# Altium schematic sheet Sheet1.SchDoc
size A3
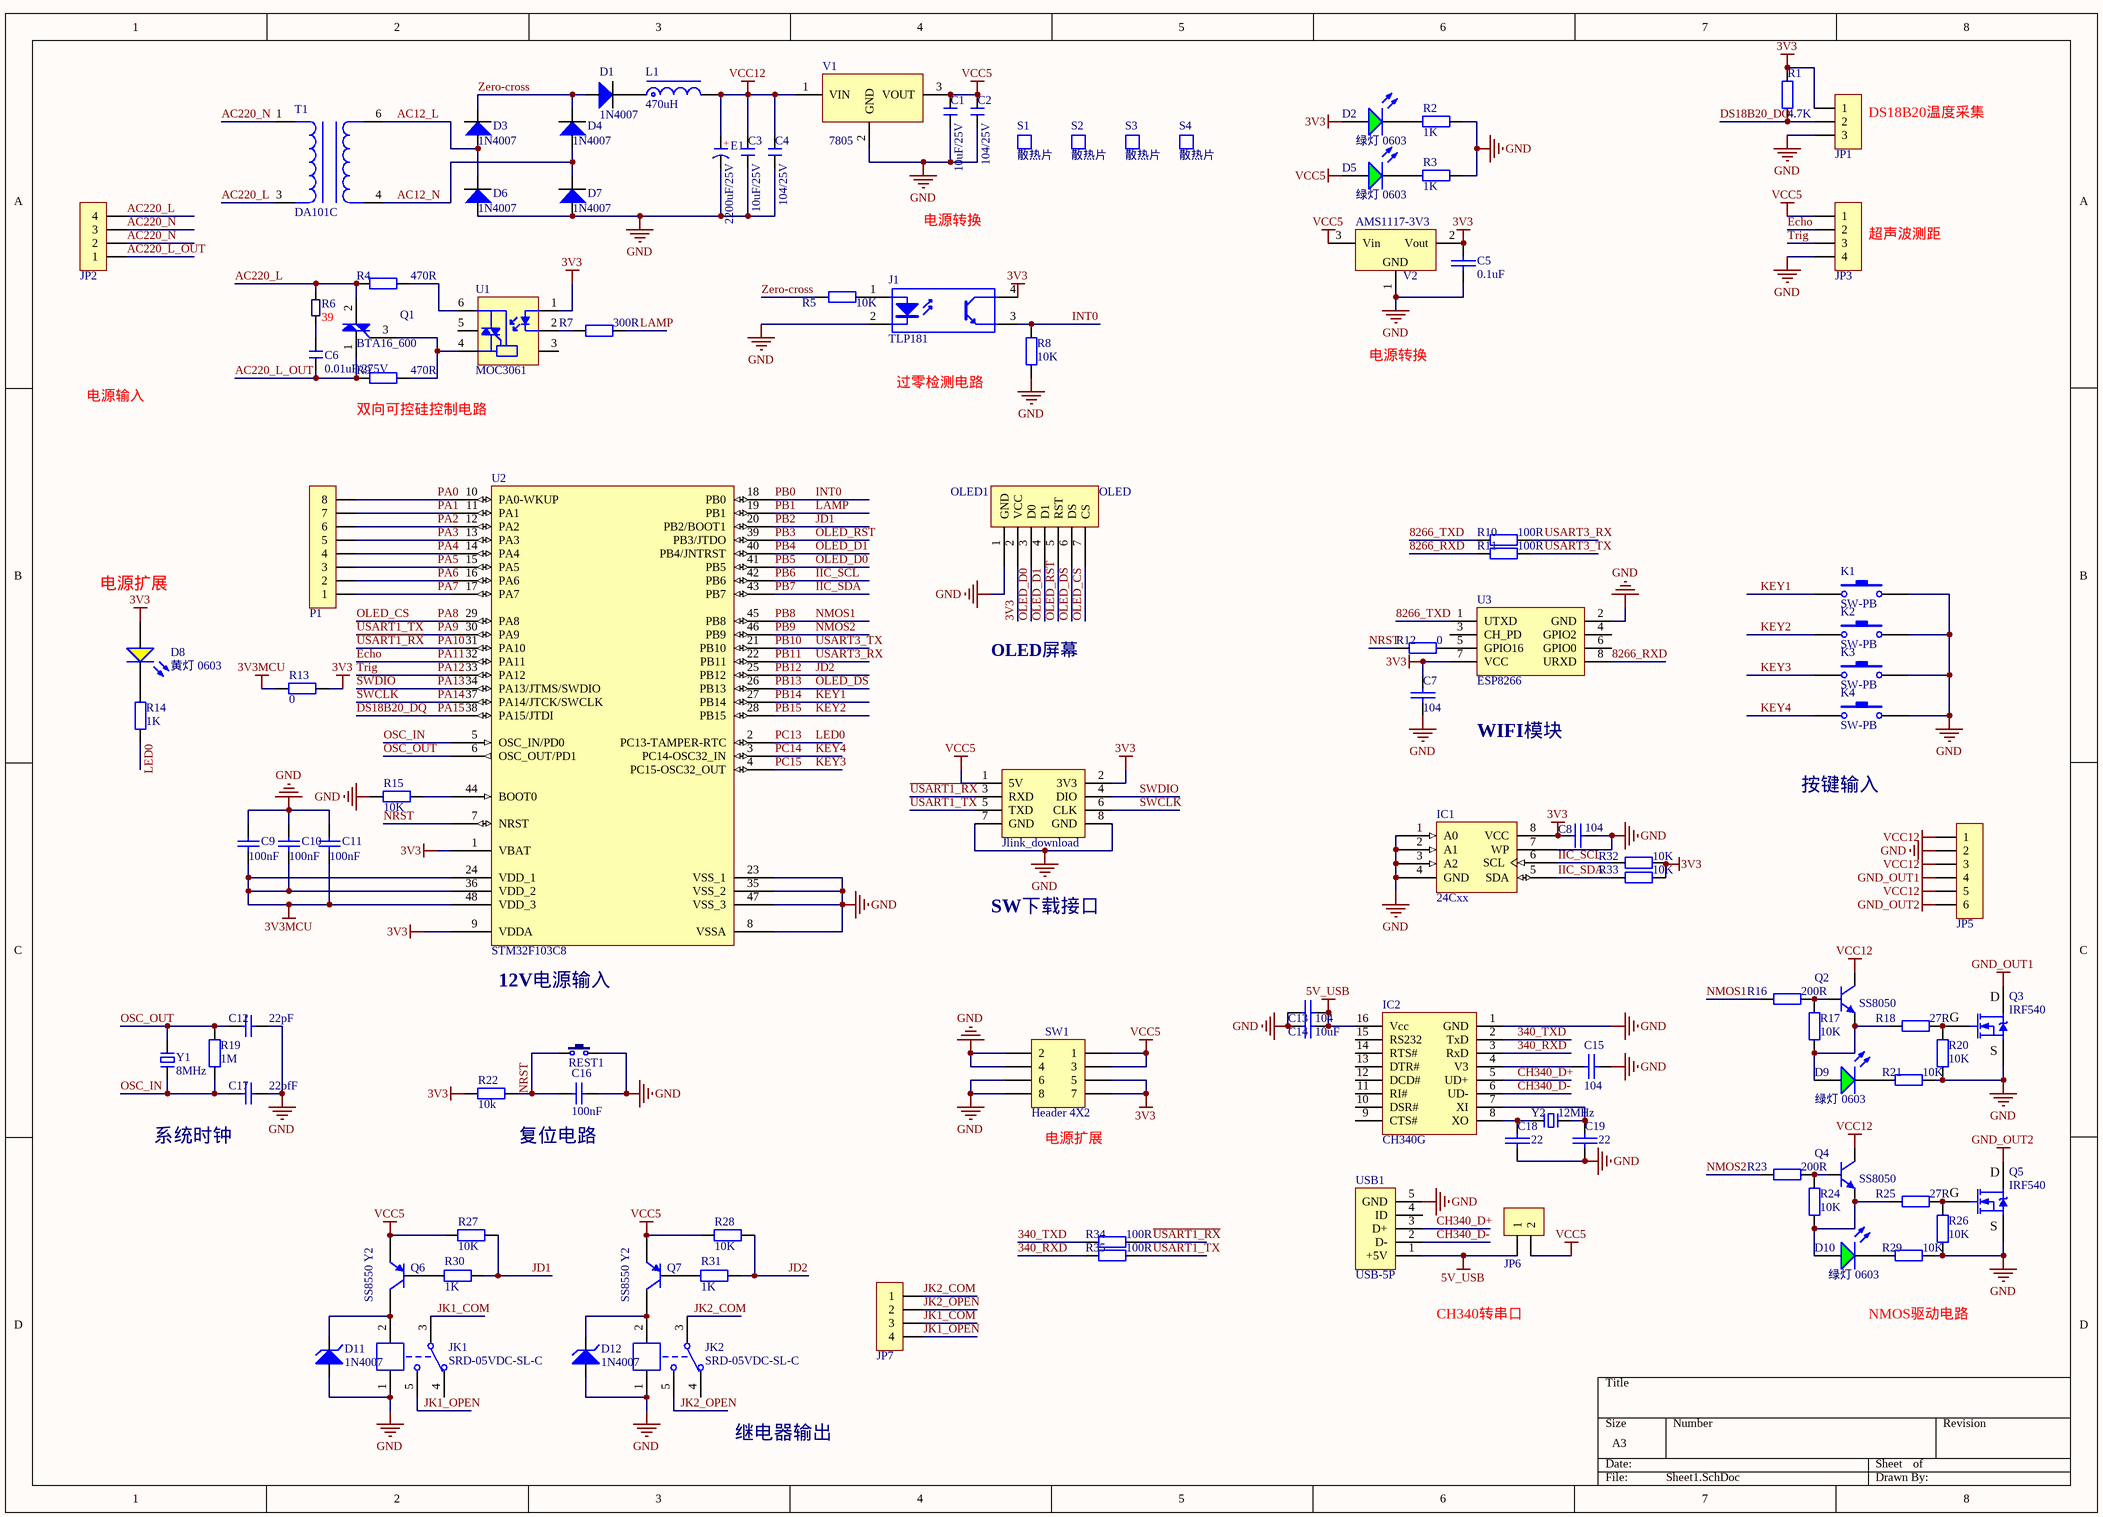
[diagram p0: Sheet1.SchDoc]

## Parts
*1  Jlink_download  [HDR2.54-M-LI-2x4P]
C1  10uF/25V  [LC-0805_C]
C2  104/25V  [LC-0603_C]
C3  10uF/25V  [LC-0805_C]
C4  104/25V  [LC-0603_C]
C5  0.1uF  [LC-0603_C]
C6  0.01uF/275V  [CBB 10*12*8]
C7  104  [LC-0603_C]
C8  104  [LC-0603_C]
C9  100nF  [LC-0603_C]
C10  100nF  [LC-0603_C]
C11  100nF  [LC-0603_C]
C12  22pF  [LC-0603_C]
C13  104  [LC-0603_C]
C14  10uF  [LC-0805_C]
C15  104  [LC-0603_C]
C16  100nF  [LC-0603_C]
C17  22pfF  [LC-0603_C]
C18  22  [LC-0603_C]
C19  22  [LC-0603_C]
D1  1N4007  [DO-41]
D2  绿灯 0603  [LC-0603_LED_S1]
D3  1N4007  [DO-41]
D4  1N4007  [DO-41]
D5  绿灯 0603  [LC-0603_LED_S1]
D6  1N4007  [DO-41]
D7  1N4007  [DO-41]
D8  黄灯 0603  [LC-0603_LED_S1]
D9  绿灯 0603  [LC-0603_LED_S1]
D10  绿灯 0603  [LC-0603_LED_S1]
D11  1N4007  [D1812]
D12  1N4007  [D1812]
E1  2200uF/25V  [CAP 7.5*16*31.5 - BK]
IC1  24Cxx  [SOP8_M]
IC2  CH340G  [SOP16_M]
J1  TLP181  [SOP4-W2.54_M]
JK1  SRD-05VDC-SL-C  [SRD-C_B]
JK2  SRD-05VDC-SL-C  [SRD-C_B]
JP1  HDR-1X3  [XH2.54-WI-3P]  (value not drawn)
JP2  HDR-1X4  [KF128-5.08-4P]  (value not drawn)
JP3  HDR-1X4  [XH2.54-WI-4P]  (value not drawn)
JP5  HDR-1X6  [KF128-5.08-6P]  (value not drawn)
JP6  HDR-1X2  [HDR2.54-LI-2P]  (value not drawn)
JP7  HDR-1X4  [KF128-5.08-4P]  (value not drawn)
K1  SW-PB  [TSW DIP-6*6*5]
K2  SW-PB  [TSW DIP-6*6*5]
K3  SW-PB  [TSW DIP-6*6*5]
K4  SW-PB  [TSW DIP-6*6*5]
L1  470uH  [LMR135]
OLED1  OLED  [OLED_096]
P1  HDR-1X8  [HDR2.54-LI-8P]  (value not drawn)
Q1  BTA16_600  [TO220A]
Q2  SS8050  [SOT23-3L]
Q3  IRF540  [TO220A]
Q4  SS8050  [SOT23-3L]
Q5  IRF540  [TO220A]
Q6  SS8550 Y2  [LC-SOT-23(SOT-23-3)]
Q7  SS8550 Y2  [LC-SOT-23(SOT-23-3)]
R1  4.7K  [LC-0603_R]
R2  1K  [LC-0603_R]
R3  1K  [LC-0603_R]
R4  470R  [RS 1/2W]
R5  10K  [LC-0603_R]
R6  39  [RS 2W]
R7  300R  [LC-0603_R]
R8  10K  [LC-0603_R]
R9  470R  [RS 1/2W]
R10  100R  [LC-0603_R]
R11  100R  [LC-0603_R]
R12  0  [LC-0603_R]
R13  0  [LC-0603_R]
R14  1K  [LC-0603_R]
R15  10K  [LC-0603_R]
R16  200R  [LC-0603_R]
R17  10K  [LC-0603_R]
R18  27R  [LC-0603_R]
R19  1M  [LC-0603_R]
R20  10K  [LC-0603_R]
R21  10K  [LC-0603_R]
R22  10k  [LC-0603_R]
R23  200R  [LC-0603_R]
R24  10K  [LC-0603_R]
R25  27R  [LC-0603_R]
R26  10K  [LC-0603_R]
R27  10K  [LC-0603_R]
R28  10K  [LC-0603_R]
R29  10K  [LC-0603_R]
R30  1K  [LC-0603_R]
R31  1K  [LC-0603_R]
R32  10K  [LC-0603_R]
R33  10K  [LC-0603_R]
R34  100R  [LC-0603_R]
R35  100R  [LC-0603_R]
REST1  3x6x5  [TSW SMD-3*6*2.5]  (value not drawn)
S1  散热片  [SRP10-15-21-P]
S2  散热片  [SRP10-15-21-P]
S3  散热片  [SRP10-15-21-P]
S4  散热片  [SRP10-15-21-P]
SW1  Header 4X2  [HDR2.54-LI-2x4P]
T1  DA101C  [Transformer_28mm]
U1  MOC3061  [DIP6-300]
U2  STM32F103C8  [LQFP48 7X7_M]
U3  ESP8266  [2*4HEADER]
USB1  USB-5P  [USB-MICRO_A]
V1  7805  [TO220A]
V2  AMS1117-3V3  [SOT223_N]
Y1  8MHz  [OSC HC-49S]
Y2  12MHz  [OSC HC-49S]

## Nets
3V3: *1.2(3V3) C5.2 C7.2 C8.2 D2.A D8.A IC1.8(VCC) J1.4(C) JP1.1 OLED1.2(VCC) R1.1 R13.1 R22.1 R32.1 R33.1 SW1.5 SW1.7 U1.1(+) U2.1(VBAT) U2.9(VDDA) U3.7(VCC) V2.2(Vout)
3V3MCU: C9.1 C10.1 C11.1 R13.2 U2.24(VDD_1) U2.36(VDD_2) U2.48(VDD_3)
5V_USB: C13.1 C14.1 IC2.16(Vcc) JP6.1 USB1.1(+5V)
GND: *1.7(GND) *1.8(GND) C1.1 C2.1 C3.1 C4.1 C5.1 C7.1 C8.1 C9.2 C10.2 C11.2 C12.2 C13.2 C14.2 C15.1 C16.2 C17.2 C18.2 C19.2 D6.1 D7.1 D11.1(A) D12.1(A) E1.2(K) IC1.1(A0) IC1.2(A1) IC1.3(A2) IC1.4(GND) IC1.7(WP) IC2.1(GND) J1.2(K) JK1.1 JK2.1 JP1.3 JP3.4 JP5.2 K1.2 K2.2 K3.2 K4.2 OLED1.1(GND) Q3.3(S) Q5.3(S) R2.1 R3.1 R8.1 R15.2 R20.2 R21.1 R26.2 R29.1 REST1.2 SW1.2 SW1.4 SW1.6 SW1.8 U2.8(VSSA) U2.23(VSS_1) U2.35(VSS_2) U2.47(VSS_3) U3.2(GND) USB1.5(GND) V1.2(GND) V2.1(GND)
GND_OUT1: JP5.4 Q3.2(D)
GND_OUT2: JP5.6 Q5.2(D)
VCC5: *1.1(5V) C1.2 C2.2 D5.A JP3.1 JP6.2 Q6.2(E) Q7.2(E) R27.2 R28.2 SW1.1 SW1.3 V1.3(VOUT) V2.3(Vin)
VCC12: C3.2 C4.2 E1.1(A) JP5.1 JP5.3 JP5.5 L1.2 Q2.3(C) Q4.3(C) V1.1(VIN)
340_RXD: IC2.3(RxD) R35.2
340_TXD: IC2.2(TxD) R34.2
8266_RXD: R11.2 U3.8(URXD)
8266_TXD: R10.2 U3.1(UTXD)
~{USART1_RX}: *1.3(RXD) R34.1 U2.31(PA10)  [also labelled PA10]
AC12_L: D3.1 D6.2 T1.6
AC12_N: D4.1 D7.2 T1.4
AC220_L: JP2.4 Q1.2(A2) R4.1 R6.2 T1.3
AC220_L_OUT: C6.1 JP2.1 Q1.1(A1) R9.1
AC220_N: JP2.2 JP2.3 T1.1
CH340_D+: IC2.5(UD+) USB1.3(D+)
CH340_D-: IC2.6(UD-) USB1.2(D-)
DS18B20_DQ: JP1.2 R1.2 U2.38(PA15/JTDI)  [also labelled PA15]
Echo: JP3.2 U2.32(PA11)  [also labelled PA11]
IIC_SCL: IC1.6(SCL) R32.2 U2.42(PB6)  [also labelled PB6]
IIC_SDA: IC1.5(SDA) R33.2 U2.43(PB7)  [also labelled PB7]
INT0: J1.3(E) R8.2 U2.18(PB0)  [also labelled PB0]
JD1: R27.1 R30.1 U2.20(PB2/BOOT1)  [also labelled PB2]
JD2: R28.1 R31.1 U2.25(PB12)  [also labelled PB12]
JK1_COM: JK1.3 JP7.3
JK1_OPEN: JK1.5 JP7.4
JK2_COM: JK2.3 JP7.1
JK2_OPEN: JK2.5 JP7.2
KEY1: K1.1 U2.27(PB14)  [also labelled PB14]
KEY2: K2.1 U2.28(PB15)  [also labelled PB15]
KEY3: K3.1 U2.4(PC15-OSC32_OUT)  [also labelled PC15]
KEY4: K4.1 U2.3(PC14-OSC32_IN)  [also labelled PC14]
LAMP: R7.2 U2.19(PB1)  [also labelled PB1]
LED0: R14.2 U2.2(PC13-TAMPER-RTC)  [also labelled PC13]
NMOS1: R16.2 U2.45(PB8)  [also labelled PB8]
NMOS2: R23.2 U2.46(PB9)  [also labelled PB9]
NRST: C16.1 R12.2 R22.2 REST1.1 U2.7(NRST)
OLED_CS: OLED1.7(CS) U2.29(PA8)  [also labelled PA8]
OLED_D0: OLED1.3(D0) U2.41(PB5)  [also labelled PB5]
OLED_D1: OLED1.4(D1) U2.40(PB4/JNTRST)  [also labelled PB4]
OLED_DS: OLED1.6(DS) U2.26(PB13)  [also labelled PB13]
OLED_RST: OLED1.5(RST) U2.39(PB3/JTDO)  [also labelled PB3]
OSC_IN: C17.1 R19.1 U2.5(OSC_IN/PD0) Y1.1
OSC_OUT: C12.1 R19.2 U2.6(OSC_OUT/PD1) Y1.2
PA0: P1.8 U2.10(PA0-WKUP)
PA1: P1.7 U2.11(PA1)
PA2: P1.6 U2.12(PA2)
PA3: P1.5 U2.13(PA3)
PA4: P1.4 U2.14(PA4)
PA5: P1.3 U2.15(PA5)
PA6: P1.2 U2.16(PA6)
PA7: P1.1 U2.17(PA7)
PA9: *1.5(TXD) R35.1 U2.30(PA9)  [also labelled USART1_TX]
PA12: JP3.3 U2.33(PA12)  [also labelled Trig]
PA13: *1.4(DIO) U2.34(PA13/JTMS/SWDIO)  [also labelled SWDIO]
PA14: *1.6(CLK) U2.37(PA14/JTCK/SWCLK)  [also labelled SWCLK]
PB10: R11.1 U2.21(PB10)  [also labelled USART3_TX]
PB11: R10.1 U2.22(PB11)  [also labelled USART3_RX]
Zero-cross: D1.1 D3.2 D4.2 R5.1
NetC6_2: C6.2 R6.1
NetC15_2: C15.2 IC2.4(V3)
NetC18_1: C18.1 IC2.8(XO) Y2.2
NetC19_1: C19.1 IC2.7(XI) Y2.1
NetD1_2: D1.2 L1.1
NetD2_K: D2.K R2.2
NetD5_K: D5.K R3.2
NetD8_K: D8.K R14.1
NetD9_A: D9.A Q2.2(E) R17.2 R18.2
NetD9_K: D9.K R21.2
NetD10_A: D10.A Q4.2(E) R24.2 R25.2
NetD10_K: D10.K R29.2
NetD11_2: D11.2(K) JK1.2 Q6.3(C)
NetD12_2: D12.2(K) JK2.2 Q7.3(C)
NetJ1_1: J1.1(A) R5.2
NetQ1_3: Q1.3(G) R9.2 U1.4
NetQ2_1: Q2.1(B) R16.1 R17.1
NetQ3_1: Q3.1(G) R18.1 R20.1
NetQ4_1: Q4.1(B) R23.1 R24.1
NetQ5_1: Q5.1(G) R25.1 R26.1
NetQ6_1: Q6.1(B) R30.2
NetQ7_1: Q7.1(B) R31.2
NetR4_2: R4.2 U1.6
NetR7_1: R7.1 U1.2(-)
NetR12_1: R12.1 U3.5(GPIO16)
NetR15_1: R15.1 U2.44(BOOT0)

Not connected (* = marked no-connect by the designer): IC2 9(CTS#) 10(DSR#) 11(RI#) 12(DCD#) 13(DTR#) 14(RTS#) 15(RS232); JK1 4; JK2 4; U1 3(NC) 5; U3 3(CH_PD) 4(GPIO2) 6(GPIO0); USB1 4(ID)

## Notes on the sheet
- (near JP1) DS18B20温度采集
- 电源转换
- (near JP3) 超声波测距
- (near J1) 过零检测电路
- 电源输入
- (near R9) 双向可控硅控制电路
- 电源扩展
- OLED屏幕
- WIFI模块
- 按键输入
- SW下载接口
- 12V电源输入
- 系统时钟
- 复位电路
- (near SW1) 电源扩展
- CH340转串口
- NMOS驱动电路
- 继电器输出
- (in symbol C-CAP) +

## Library data of the parts
*1 = Jlink_下载器: Jlink下载器
C1-C4 = C: 无极性贴片电容; 版权归属: 源创客; BOM名称: 无极性贴片电容; 学习资源: www.ooocke.com
C5 C7 C8 C13-C15 C18 C19 = 0805C: Capacitor 0805
C6 = C-CBB: CBB电容; 版权归属: 源创客; BOM名称: CBB电容; 学习资源: www.ooocke.com
C9-C12 C16 C17 = Cap: 无极性电容; Published: 8-Jun-2000; LatestRevisionDate: 17-Jul-2002; LatestRevisionNote: Re-released for DXP Platform.; PackageReference: RAD-0.3; Publisher: Altium Limited
D2 D5 D9 D10 = 0603 绿灯: 发光二极管; ComponentLink1Description: 供应商链接; ComponentLink1URL: http://www.szlcsc.com/product/details_73152.html; Package: 0603; Supplier: LC; SuppliersPartNumber: C72043
D8 = 0603 黄灯: 发光二极管; ComponentLink1Description: 供应商链接; ComponentLink1URL: http://www.szlcsc.com/product/details_73147.html; Package: 0603; Supplier: LC; SuppliersPartNumber: C72038
D11 D12 = 1N4007: Zener Diode
E1 = C-CAP: 直插电解电容; 版权归属: 源创客; BOM名称: 直插电解电容; 学习资源: www.ooocke.com
IC1 = 24Cxx: 外置EEPROM; 版权归属: 源创客; BOM名称: 外置EEPROM; 学习资源: www.ooocke.com
IC2 = CH340G: 串口转USB; 版权归属: 源创客; BOM名称: 串口转USB; 学习资源: www.ooocke.com
J1 = TLP181: 光耦; 版权归属: 源创客; BOM名称: 光耦; 学习资源: www.ooocke.com
JK1 JK2 = SRD-05VDC-SL-C: 5V一组转换; BOM名称: 5V继电器; 版权归属: 源创客; 学习资源: www.ooocke.com
JP1 = Header 3: 3P接插件; 版权归属: 源创客; BOM名称: 3P接插件; 学习资源: www.ooocke.com
JP2 JP3 JP7 = Header 4: 4P接插件; 版权归属: 源创客; BOM名称: 4P接插件; 学习资源: www.ooocke.com
JP5 = Header 6: 6P接插件; 版权归属: 源创客; BOM名称: 6P接插件; 学习资源: www.ooocke.com
JP6 = Header 2: 2P接插件; 版权归属: 源创客; BOM名称: 2P接插件; 学习资源: www.ooocke.com
K1-K4 = SW-PB: Switch; Published: 24-Mar-1999; LatestRevisionDate: 17-Jul-2002; LatestRevisionNote: Re-released for DXP Platform.; PackageReference: SPST-2; Publisher: Altium Limited; PackageDescription: Switch; 2 Leads
L1 = L-MR: 功率磁环电感; 版权归属: 源创客; BOM名称: 功率磁环电感; 学习资源: www.ooocke.com
OLED1 = OLED_SPI: OLED屏幕
P1 = Header 8: 8P接插件; 版权归属: 源创客; BOM名称: 8P接插件; 学习资源: www.ooocke.com
Q1 = BTA12_600: 双向可控硅; 版权归属: 源创客; BOM名称: 双向可控硅; 学习资源: www.ooocke.com
Q2 Q4 = 8050-SMD: 高频放大-NPN型; 版权归属: 源创客; 属性: 40V 1.5A 1W 100MHZ; BOM名称: 高频放大-NPN型; 学习资源: www.ooocke.com
Q3 Q5 = IRF840: N沟场效应管; 版权归属: 源创客; BOM名称: N沟场效应管; 学习资源: www.ooocke.com
Q6 Q7 = SOT-23 SS8550 Y2: 三极管; ComponentLink1Description: 供应商链接; ComponentLink1URL: http://www.szlcsc.com/product/details_9037.html; Package: SOT-23; Supplier: LC; SuppliersPartNumber: C8542
R1 R5 R7 R8 R10-R13 R15-R20 R22-R26 R34 R35 = Res1: 贴片电阻; Value: 1K; Published: 8-Jun-2000; LatestRevisionDate: 17-Jul-2002; LatestRevisionNote: Re-released for DXP Platform.; PackageReference: AXIAL-0.4; Publisher: Altium Limited
R2 R3 R21 R27-R33 = 0603 1.1KΩ (1101) 1%: 贴片电阻; ComponentLink1Description: 供应商链接; ComponentLink1URL: http://www.szlcsc.com/product/details_23491.html; Package: 0603; Supplier: LC; SuppliersPartNumber: C22764
R4 R9 = R-CRR: 直插色环电阻; BOM名称: 色环电阻; 版权归属: 源创客; 学习资源: www.ooocke.com
R6 = RES-0603
R14 = Res1: 贴片电阻; Published: 8-Jun-2000; LatestRevisionDate: 17-Jul-2002; LatestRevisionNote: Re-released for DXP Platform.; PackageReference: AXIAL-0.4; Publisher: Altium Limited; Value: 1K
REST1 = TSW 3x6: 3x6轻触开关; 版权归属: 源创客; BOM名称: 3x6轻触开关; 学习资源: www.ooocke.com
S1-S4 = S1: 版权归属: 源创客; BOM名称: 散热片; 学习资源: www.ooocke.com
SW1 = Header 4X2: Header, 4-Pin, Dual row; LatestRevisionDate: 17-Jul-2002; LatestRevisionNote: Re-released for DXP Platform.; Publisher: Altium Limited
T1 = DA10XC: 数字隔离变压器; 版权归属: 源创客; ROM名称: 数字隔离变压器; 学习资源: www.ooocke.com
U1 = MOC3061: 零点触发光可控硅; BOM名称: 光可控硅; 版权归属: 源创客; 学习资源: www.ooocke.com
U2 = STM32F103C8: Flaah:64/RAM:20/IO:36; BOM名称: 32位STM单片机; 版权归属: 源创客; 学习资源: www.ooocke.com
U3 = ESP8266: WIFI通信模块
USB1 = USB-5P: 微型USB母座; 版权归属: 源创客; BOM名称: 微型USB母座; 学习资源: www.ooocke.com
V1 = 78xx: 线性稳压芯片; 版权归属: 源创客; BOM名称: 线性稳压芯片; 学习资源: www.ooocke.com
V2 = AMS1117: 三端稳压芯片; BOM名称: 稳压芯片; 版权归属: 源创客; 学习资源: www.ooocke.com
Y1 Y2 = XTAL-2P: 2脚无源脚晶振; 版权归属: 源创客; BOM名称: 2脚无源脚晶振; 学习资源: www.ooocke.com